# EAGLE schematic cuisinart-oven (EAGLE 8.6.2)
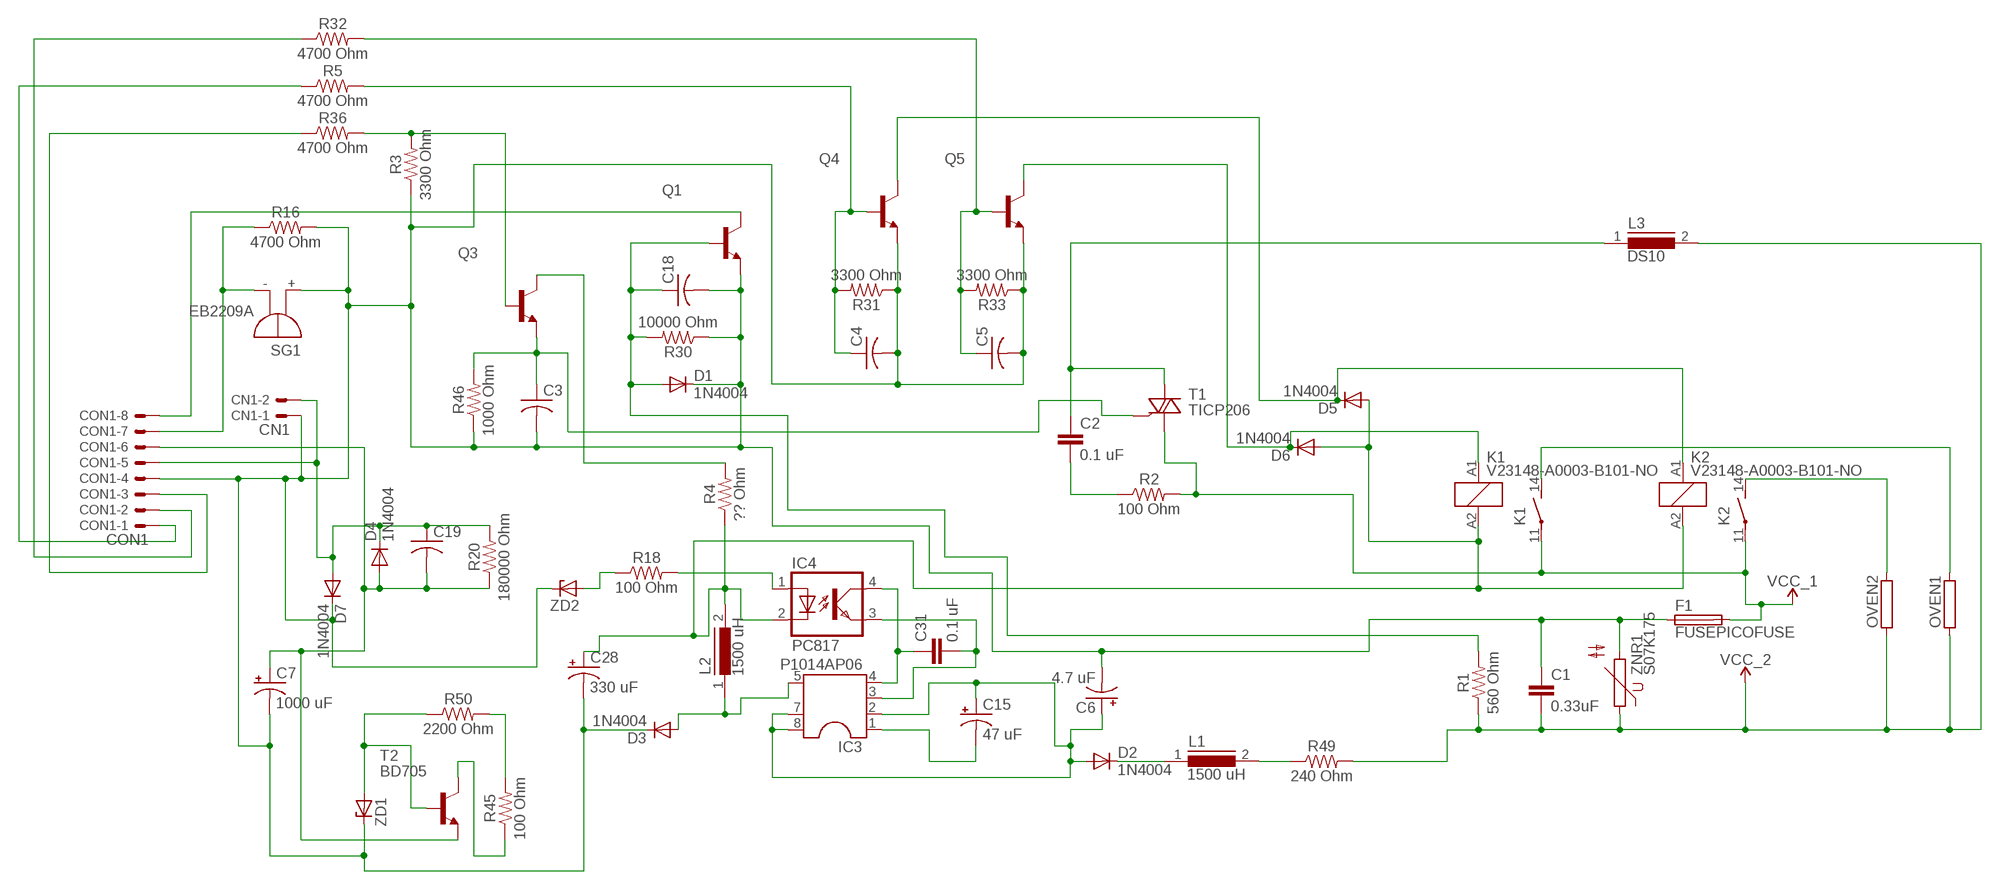
[diagram p0: schematic, sheet 1]

## Parts
C1  0.33uF  C15/9  [C15B9]
C2  0.1 uF  CXXC15B6  [XC15B6]
C3  C-US025-024X044  [C025-024X044]
C4  C-US025-024X044  [C025-024X044]
C5  C-US025-024X044  [C025-024X044]
C6  4.7 uF  CPOL-USE3.5-8  [E3,5-8]
C7  1000 uF  CPOL-USE3.5-8  [E3,5-8]
C15  47 uF  CPOL-USE2-5  [E2-5]
C18  C-US025-024X044  [C025-024X044]
C19  C-US025-024X044  [C025-024X044]
C28  330 uF  CPOL-USE3.5-10  [E3,5-10]
C31  0.1 uF  CXXC15B6  [XC15B6]
CN1  CN1  22-23-2021  [22-23-2021]
CON1  CON1  22-23-2081  [22-23-2081]
D1  1N4004  [DO41-10]
D2  1N4004  [DO41-10]
D3  1N4004  [DO41-10]
D4  1N4004  [DO41-10]
D5  1N4004  [DO41-10]
D6  1N4004  [DO41-10]
D7  1N4004  [DO41-10]
F1  FUSEPICOFUSE  [PICOFUSE]
IC3  P1014AP06  TNY267PN  [DIP-8B]
IC4  PC817  [DIL04]
K1  V23148-A0003-B101-NO  [V23148-NO]
K2  V23148-A0003-B101-NO  [V23148-NO]
L1  1500 uH  82114R  [82114R]
L2  1500 uH  82114R  [82114R]
L3  DS10  [DS10]
OVEN1  RRWM10X65  [RWM10X65]
OVEN2  RRWM10X65  [RWM10X65]
Q1  BFS17-NPN-SOT23-BEC  [SOT23-BEC]
Q3  BFS17-NPN-SOT23-BEC  [SOT23-BEC]
Q4  BFS17-NPN-SOT23-BEC  [SOT23-BEC]
Q5  BFS17-NPN-SOT23-BEC  [SOT23-BEC]
R1  560 Ohm  RESISTORAXIAL-0.3  [AXIAL-0.3]
R2  100 Ohm  RESISTORAXIAL-0.3  [AXIAL-0.3]
R3  3300 Ohm  RESISTORAXIAL-0.3  [AXIAL-0.3]
R4  ?? Ohm  RESISTORAXIAL-0.3  [AXIAL-0.3]
R5  4700 Ohm  RESISTORAXIAL-0.3  [AXIAL-0.3]
R16  4700 Ohm  RESISTORAXIAL-0.3  [AXIAL-0.3]
R18  100 Ohm  RESISTORAXIAL-0.3  [AXIAL-0.3]
R20  180000 Ohm  RESISTORAXIAL-0.3  [AXIAL-0.3]
R30  10000 Ohm  RESISTORAXIAL-0.3  [AXIAL-0.3]
R31  3300 Ohm  RESISTORAXIAL-0.3  [AXIAL-0.3]
R32  4700 Ohm  RESISTORAXIAL-0.3  [AXIAL-0.3]
R33  3300 Ohm  RESISTORAXIAL-0.3  [AXIAL-0.3]
R36  4700 Ohm  RESISTORAXIAL-0.3  [AXIAL-0.3]
R45  100 Ohm  RESISTORAXIAL-0.3  [AXIAL-0.3]
R46  1000 Ohm  RESISTORAXIAL-0.3  [AXIAL-0.3]
R49  240 Ohm  RESISTORAXIAL-0.3  [AXIAL-0.3]
R50  2200 Ohm  RESISTORAXIAL-0.3  [AXIAL-0.3]
SG1  EB2209A  [EB2209A]
T1  TICP206  [TO92-6]
T2  BD705  [TO220]
ZD1  ZENER_DIODEDO41Z10  [DO41Z10]
ZD2  ZENER_DIODEDO41Z10  [DO41Z10]
ZNR1  S07K175  [S07K175]

## Nets
N$1: L1.2 R49.P$1
N$2: C2.2 R2.P$1
N$3: C28.+ D5.A D6.A IC4.2(C) K1.A2 K2.A2 L2.2 R4.P$1
N$4: K2.14(2:S) OVEN2.2
N$5: K1.14(2:S) OVEN1.2
N$6: D5.C K2.A1 Q4.C
N$7: D2.C L1.1
N$8: D6.C K1.A1 Q5.C
N$9: C6.+ C15.+ D2.A IC3.2(2GND) IC3.7(7HV-GND) IC3.8(8HV-GND)
N$10: CON1.3 R36.P$1
N$11: C15.- IC3.1(BP)
N$12: C2.1 L3.1 T1.A2
N$13: C31.2 IC3.3(3GND) IC4.3(EMIT)
N$14: C1.1 C3.2 C4.2 C5.2 C6.- C7.- C18.2 C28.- CN1.1 CON1.4 D1.C D3.C D7.C F1.1 Q1.E Q4.E Q5.E R3.P$1 R16.P$2 R30.P$1 R31.P$1 R33.P$1 R46.P$1 SG1.+ ZD1.C(CATHODE) ZD2.C(CATHODE) ZNR1.2
N$15: C31.1 IC3.4(EN/UV) IC4.4(COL)
N$16: IC4.1(A) R18.P$2
N$17: D3.A IC3.5(D) L2.1
N$18: R18.P$1 ZD2.A(ANODE)
N$19: C18.1 D1.A Q1.B R1.P$2 R30.P$2
N$20: CON1.7 R16.P$1 SG1.-
N$21: R45.P$1 T2.2(C)
N$22: R45.P$2 R50.P$2
N$23: R50.P$1 T2.1(B) ZD1.A(ANODE)
N$25: C19.1 CN1.2 CON1.5 D4.C D7.A R20.P$2
N$26: Q3.B R3.P$2 R36.P$2
N$27: Q3.C R4.P$2
N$28: C3.1 Q3.E R46.P$2 T1.G
N$29: CON1.8 Q1.C
N$30: C5.1 Q5.B R32.P$2 R33.P$2
N$31: C7.+ C19.2 CON1.6 D4.A R20.P$1 T2.3(E)
N$33: C4.1 Q4.B R5.P$2 R31.P$2
N$34: CON1.2 R32.P$1
N$37: CON1.1 R5.P$1
VCC_1: F1.2 K1.11(2:P) K2.11(2:P) R2.P$2 T1.A1
VCC_2: C1.2 L3.2 OVEN1.1 OVEN2.1 R1.P$1 R49.P$2 ZNR1.1

## Library data of the parts
C1 = capacitor-wima:C: CAPACITOR naming: grid - package width
C2 C31 = rcl:CX: X CAPACITOR for power line; SPICEPREFIX: C
C3-C5 C18 C19 = rcl:C-US: CAPACITOR, American symbol; SPICEPREFIX: C
C6 C7 C15 C28 = rcl:CPOL-US: POLARIZED CAPACITOR, American symbol; SPICEPREFIX: C
CN1 = con-molex:22-23-2021: .100" (2.54mm) Center Header - 2 Pin; MF: MOLEX; MPN: 22-23-2021; OC_FARNELL: 1462926; OC_NEWARK: 25C3832
CON1 = con-molex:22-23-2081: .100" (2.54mm) Center Header - 8 Pin; MF: MOLEX; MPN: 22-23-2081; OC_FARNELL: 1756826; OC_NEWARK: 01C7592
D1-D7 = diode:1N4004: DIODE general purpose rectifier, 1 A
F1 = fuse:FUSE: Fuse; OC_FARNELL: unknown; OC_NEWARK: unknown
IC3 = tny26x_27x:TNY267PN
IC4 = optocoupler:PC817: SHARP OPTO COUPLER; MPN: PC817X4J000F; OC_FARNELL: 9707727; OC_NEWARK: 97K7059
K1 K2 = relay:V23148-*-NO: Power PCB Relay U/UB normal open tyco/electronics; 1 pole 7 A, mono or bistabile www.schrackrelays.com/pdf/UUB.pdf; MPN: V23148-A0007-A101; OC_FARNELL: 1175042; OC_NEWARK: 48M9078
L1 L2 = inductors:82114R: INDUCTOR; SPICEPREFIX: L
L3 = inductors:DS10: INDUCTOR; SPICEPREFIX: L
OVEN1 OVEN2 = resistor-power:R: Power Resitor; OC_FARNELL: unknown; OC_NEWARK: unknown
Q1 Q3-Q5 = transistor:*-NPN-: NPN Transistror BF959 corrected 2008.03.06
R1-R5 R16 R18 R20 R30-R33 R36 R45 R46 R49 R50 = SparkFun-Resistors:RESISTOR: Generic Resistor Package
SG1 = buzzer:EB2209A: BUZZER Source: Buerklin; OC_FARNELL: unknown; OC_NEWARK: unknown
T1 = triac:TICP206: TRIAC
T2 = transistor:BD705: NPN TRANSISTOR
ZD1 ZD2 = fab:ZENER_DIODE: zener diode
ZNR1 = varistor:S07K175: VARISTOR